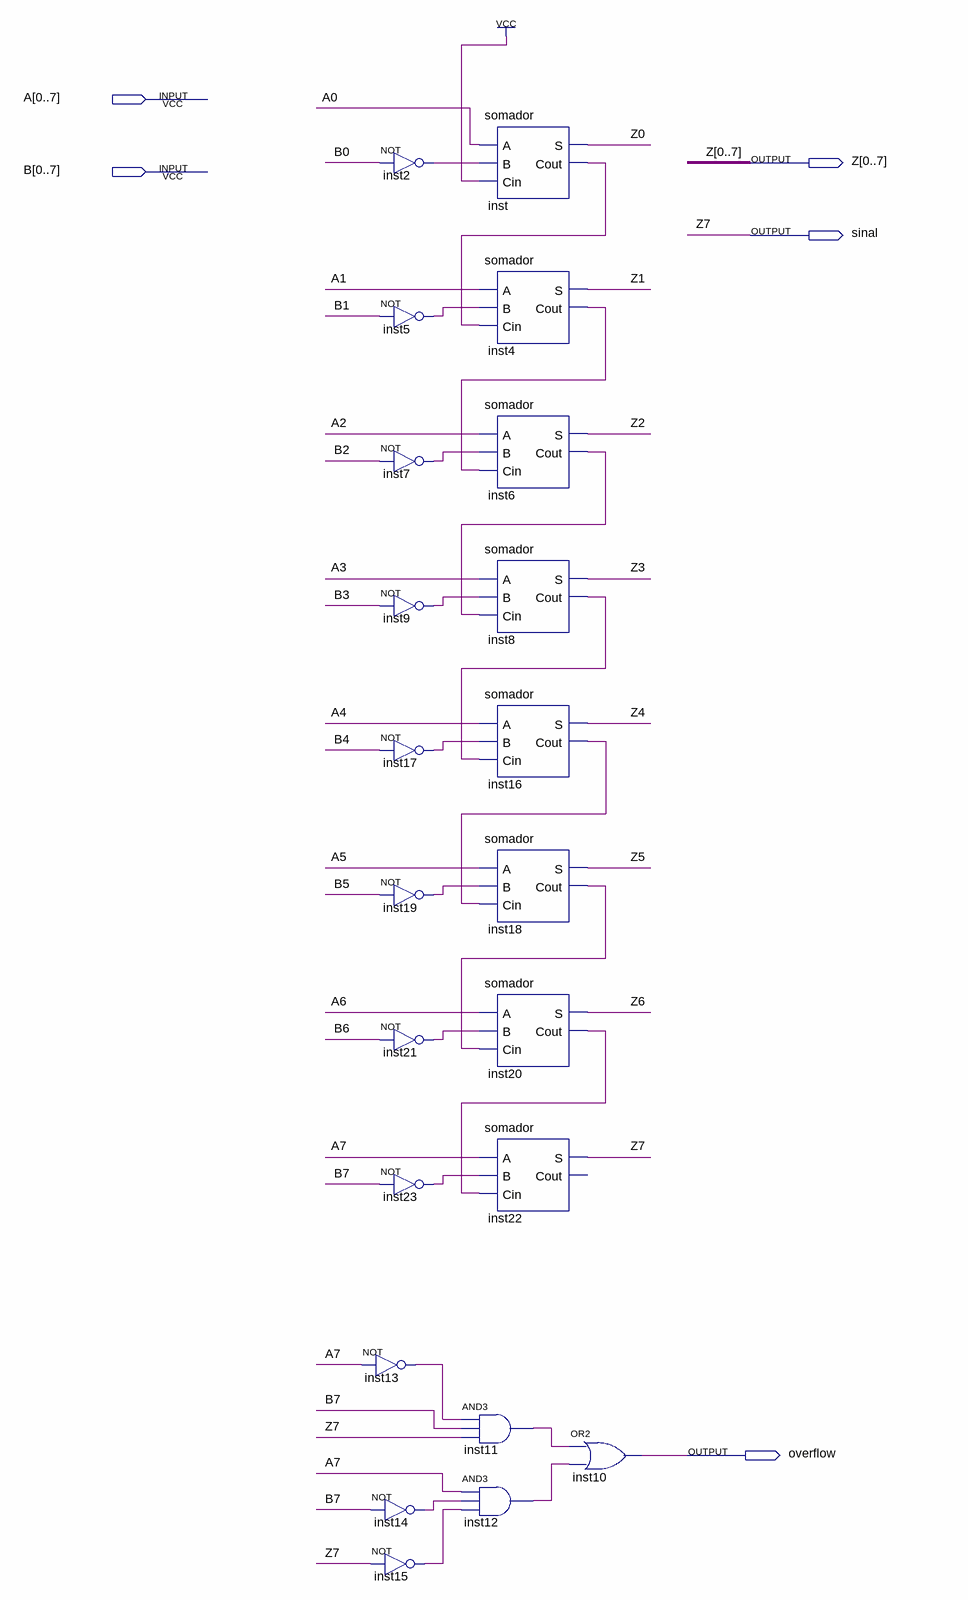
[diagram p0: schematic sheet]
// Quartus schematic subtrator8bits.bdf as structural Verilog: 22 symbols, 5 pins
module subtrator8bits (
  input  [0:7] A,
  input  [0:7] B,
  output [0:7] Z,
  output sinal,
  output overflow
);

  wire inst2_out, inst4_cout, inst5_out, inst6_cout, inst7_out, inst8_cout, inst9_out, inst11_out,
       inst12_out, inst13_out, inst14_out, inst15_out, inst16_cout, inst17_out, inst18_cout, inst19_out,
       inst20_cout, inst21_out, inst23_out, inst_cout;

  not inst2 (inst2_out, B[0]);
  not inst5 (inst5_out, B[1]);
  not inst7 (inst7_out, B[2]);
  not inst9 (inst9_out, B[3]);
  not inst17 (inst17_out, B[4]);
  not inst19 (inst19_out, B[5]);
  not inst21 (inst21_out, B[6]);
  not inst23 (inst23_out, B[7]);
  not inst13 (inst13_out, A[7]);
  not inst14 (inst14_out, B[7]);
  not inst15 (inst15_out, sinal);
  and inst11 (inst11_out, inst13_out, B[7], sinal);
  and inst12 (inst12_out, A[7], inst14_out, inst15_out);
  somador inst (.A(A[0]), .B(inst2_out), .Cin(1'b1), .S(Z[0]), .Cout(inst_cout));
  somador inst4 (.A(A[1]), .B(inst5_out), .Cin(inst_cout), .S(Z[1]), .Cout(inst4_cout));
  somador inst6 (.A(A[2]), .B(inst7_out), .Cin(inst4_cout), .S(Z[2]), .Cout(inst6_cout));
  somador inst8 (.A(A[3]), .B(inst9_out), .Cin(inst6_cout), .S(Z[3]), .Cout(inst8_cout));
  somador inst16 (.A(A[4]), .B(inst17_out), .Cin(inst8_cout), .S(Z[4]), .Cout(inst16_cout));
  somador inst18 (.A(A[5]), .B(inst19_out), .Cin(inst16_cout), .S(Z[5]), .Cout(inst18_cout));
  somador inst20 (.A(A[6]), .B(inst21_out), .Cin(inst18_cout), .S(Z[6]), .Cout(inst20_cout));
  somador inst22 (.A(A[7]), .B(inst23_out), .Cin(inst20_cout), .S(sinal));  // open: Cout
  or inst10 (overflow, inst11_out, inst12_out);

  assign Z[7] = sinal;

  // Other names for the same wires on the sheet: Z7 = sinal
endmodule
